# EAGLE schematic solar_backup_system (EAGLE 6.1)
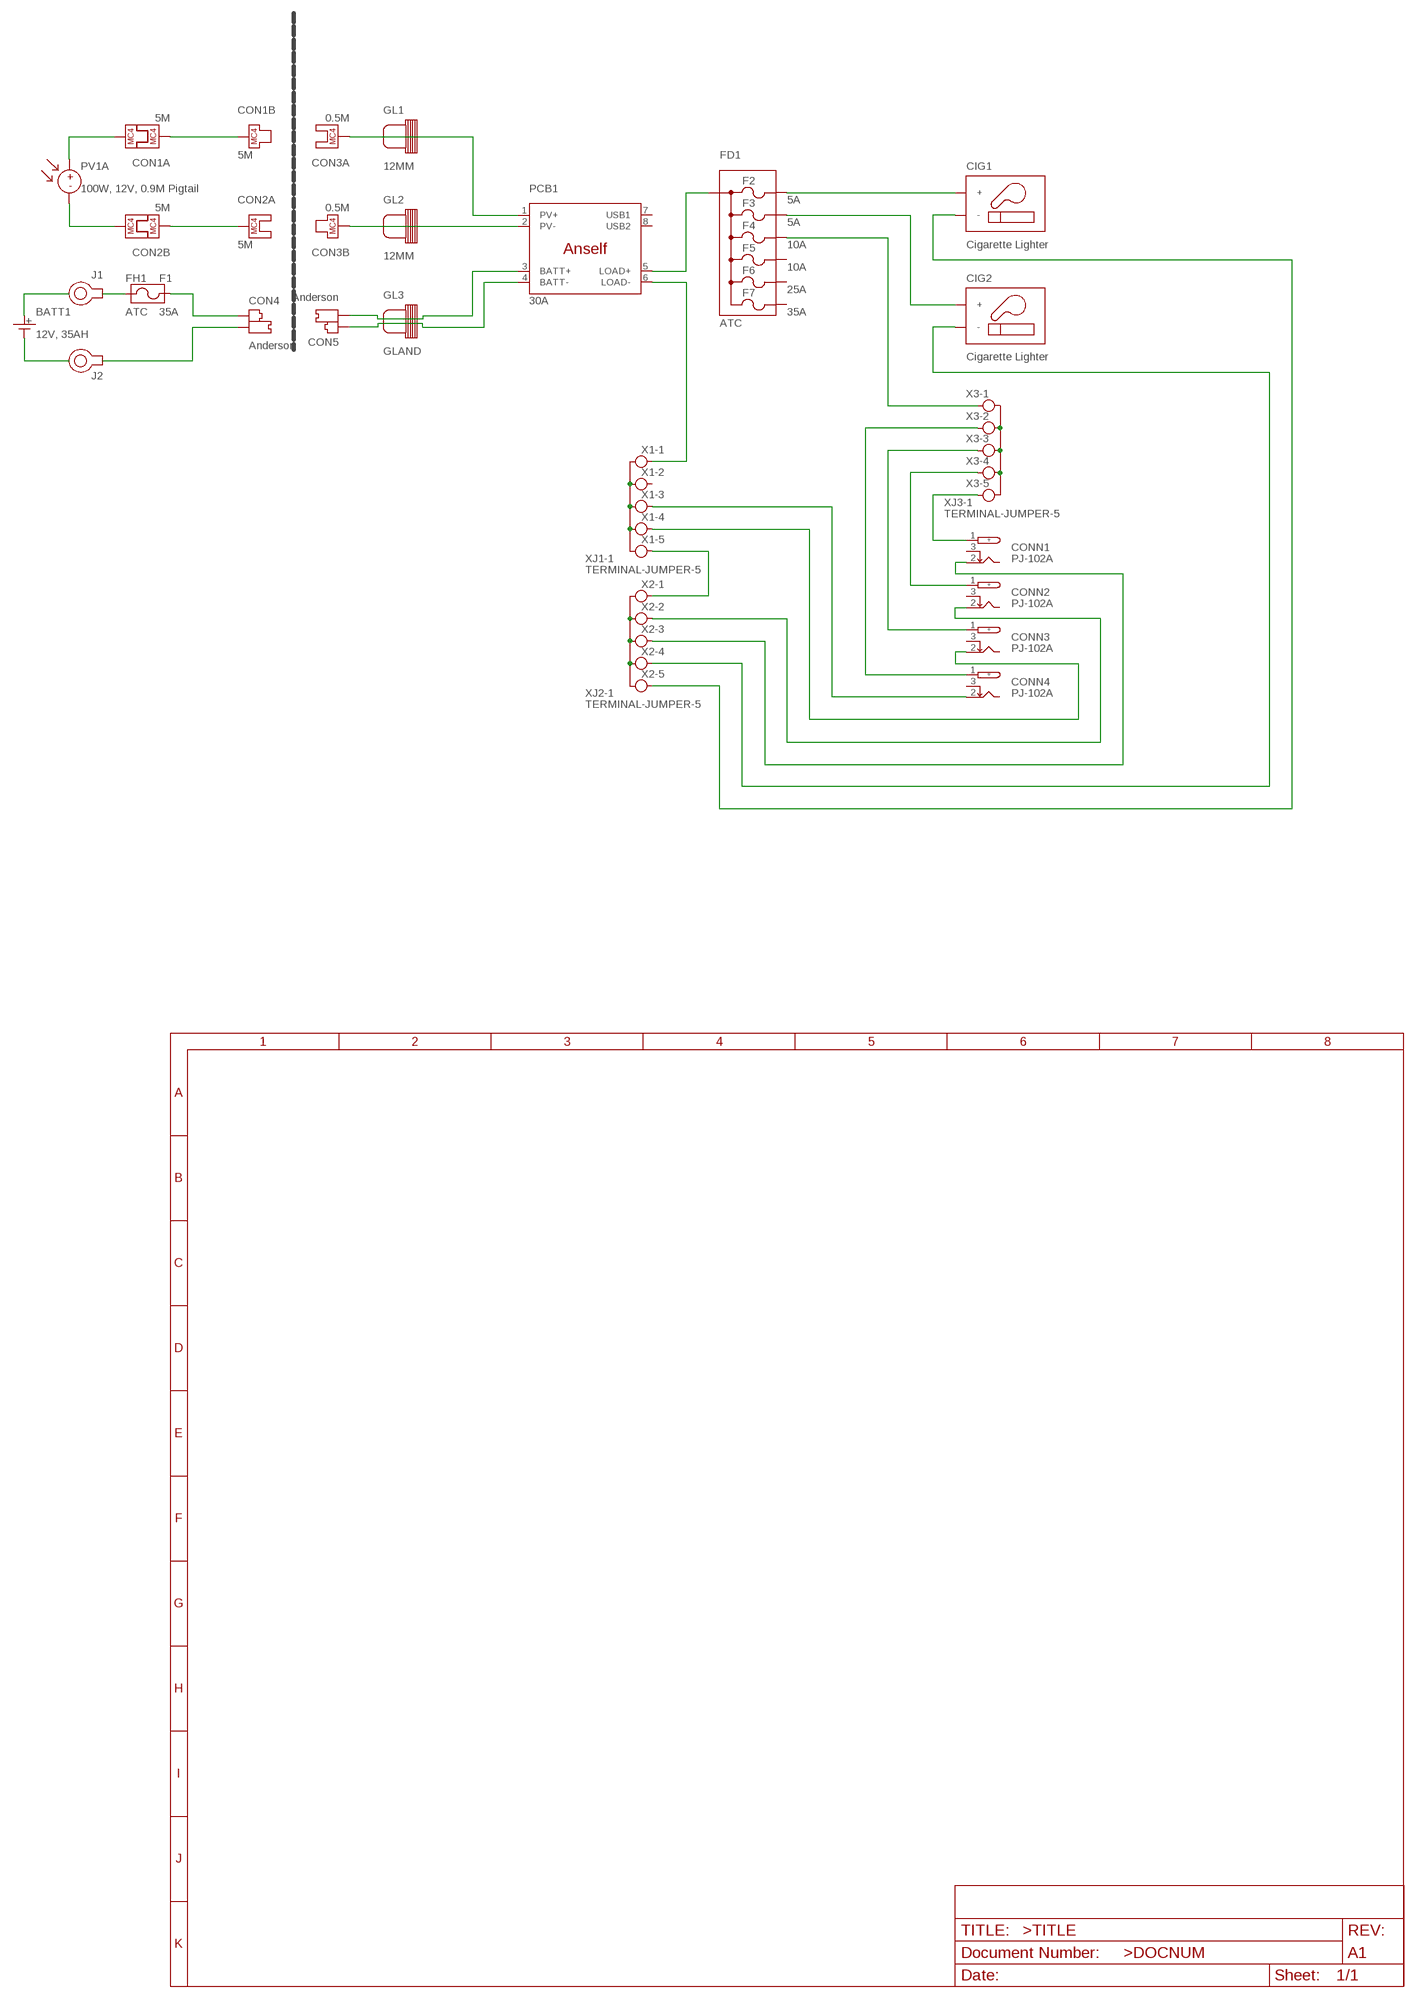
[diagram p0: schematic, sheet 1]

## Parts
BATT1  12V, 35AH  BATT-12V-35AH  [120]
CIG1  Cigarette Lighter  CIG-LIGHTER-SOCKET  [120]
CIG2  Cigarette Lighter  CIG-LIGHTER-SOCKET  [120]
CON1  5M  MC4-5M  [120]
CON2  5M  MC4-5M  [120]
CON3  0.5M  MC4-1M  [120]
CON4  Anderson  ANDERSON-POWERPOLE  [120]
CON5  Anderson  ANDERSON-POWERPOLE  [120]
CONN1  BARREL-JACK-2.1X5.5MM  [DC-BARREL-PJ-102A]
CONN2  BARREL-JACK-2.1X5.5MM  [DC-BARREL-PJ-102A]
CONN3  BARREL-JACK-2.1X5.5MM  [DC-BARREL-PJ-102A]
CONN4  BARREL-JACK-2.1X5.5MM  [DC-BARREL-PJ-102A]
F1  35A  FUSE-35A  [120]
F2  5A  FUSE-5A  [120]
F3  5A  FUSE-5A  [120]
F4  10A  FUSE-10A  [120]
F5  10A  FUSE-10A  [120]
F6  25A  FUSE-25A  [120]
F7  35A  FUSE-35A  [120]
FD1  ATC  FUSED-DISTRIBUTOR-6  [120]
FH1  ATC  FUSE-HOLDER-ATC  [120]
GL1  12MM  GLAND-12MM  [120]
GL2  12MM  GLAND-12MM  [120]
GL3  GLAND  [120]
J1  RING-TERMINAL  [120]
J2  RING-TERMINAL  [120]
PCB1  30A  ANSELF-PWM-SOLAR-CHARGE-CONTROLLER-30A  [120]
PV1  100W, 12V, 0.9M Pigtail  PV-PANEL-100W-12V  [120]
U$1  FRAME-8.5X11-LANDSCAPE-LET  [FRAME-11X17-LANDSCAPE]
X1  5POS  TERMINAL-STRIP-5-3.8MM  [120]
X2  5POS  TERMINAL-STRIP-5-3.8MM  [120]
X3  5POS  TERMINAL-STRIP-5-3.8MM  [120]
XJ1  TERMINAL-JUMPER-5  [120]
XJ2  TERMINAL-JUMPER-5  [120]
XJ3  TERMINAL-JUMPER-5  [120]

## Nets
N$1: PV1.1(A:+) PV1.3
N$2: PV1.2(A:-) PV1.5
N$3: CON1.2 PV1.4
N$4: CON2.4 PV1.6
N$5: CON1.1 CON1.3
N$6: CON2.1 CON2.3
N$7: BATT1.1(+) J1.2
N$8: BATT1.2(-) J2.2
N$9: CON3.1 PCB1.1(PV+)
N$10: CON3.3 PCB1.2(PV-)
N$11: CON4.2 J2.1
N$12: CON4.1 FH1.1
N$13: CON5.2 PCB1.3(BATT+)
N$14: CON5.1 PCB1.4(BATT-)
N$15: F1.2 FH1.3
N$16: F1.1 FH1.2
N$17: FH1.4 J1.1
N$18: X1.1 XJ1.1
N$19: X1.4 XJ1.2 XJ1.3
N$20: X1.7 XJ1.4 XJ1.5
N$21: X1.10 XJ1.6 XJ1.7
N$22: X1.13 XJ1.8
N$23: PCB1.6(LOAD-) X1.2
N$24: F2.2 FD1.9
N$25: F2.1 FD1.8
N$26: F3.2 FD1.11
N$27: F3.1 FD1.10
N$28: F4.2 FD1.13
N$29: F4.1 FD1.12
N$30: F5.2 FD1.15
N$31: F5.1 FD1.14
N$32: F6.2 FD1.17
N$33: F6.1 FD1.16
N$34: F7.2 FD1.19
N$35: F7.1 FD1.18
N$36: FD1.1 PCB1.5(LOAD+)
N$37: X2.1 XJ2.1
N$38: X2.4 XJ2.2 XJ2.3
N$39: X3.1 XJ3.1
N$40: X3.4 XJ3.2 XJ3.3
N$41: X3.7 XJ3.4 XJ3.5
N$42: X3.10 XJ3.6 XJ3.7
N$43: X2.7 XJ2.4 XJ2.5
N$44: X2.10 XJ2.6 XJ2.7
N$45: X2.13 XJ2.8
N$46: X1.14 X2.2
N$47: X3.13 XJ3.8
N$48: CIG1.1(+) FD1.2
N$49: CIG2.1(+) FD1.3
N$50: FD1.4 X3.2
N$51: CIG2.2(-) X2.11
N$52: CIG1.2(-) X2.14
N$53: CONN4.1(TIP) X3.5
N$54: CONN3.1(TIP) X3.8
N$55: CONN2.1(TIP) X3.11
N$56: CONN1.1(TIP) X3.14
N$57: CONN1.2(RING) X2.8
N$59: CONN2.2(RING) X2.5
N$60: CONN3.2(RING) X1.11
N$61: CONN4.2(RING) X1.8
Unconnected: CON1.4 CON2.2 CON3.2 CON3.4 CON4.3 CON5.3 CONN1.3(SWITCH) CONN2.3(SWITCH) CONN3.3(SWITCH) CONN4.3(SWITCH) FD1.5 FD1.6 FD1.7 PCB1.7(USB1) PCB1.8(USB2) X1.3 X1.5 X1.6 X1.9 X1.12 X1.15 X2.3 X2.6 X2.9 X2.12 X2.15 X3.3 X3.6 X3.9 X3.12 X3.15

## Library data of the parts
BATT1 = bbb:BATT; MFG: MightyMax; PN: ML35-12; VOLTAGE: 12VDC
CIG1 CIG2 = bbb:CIG-LIGHTER-SOCKET; VOLTAGE: 12VDC
CON1 CON2 = bbb:MC4
CON3 = bbb:MC4; VALUE: 1M
CON4 CON5 = bbb:ANDERSON-POWERPOLE
CONN1-CONN4 = aaa:BARREL-JACK: Barrel Jack; DIGIKEY: CP-102A-ND; MFG: CUI Inc; PN: PJ-102A
F1-F7 = bbb:FUSE; SIZE: ATC
FD1 = bbb:FUSED-DISTRIBUTOR-6; VOLTAGE: 12VDC
FH1 = bbb:FUSE-HOLDER
GL1-GL3 = bbb:GLAND
J1 J2 = bbb:RING-TERMINAL
PCB1 = bbb:ANSELF-PWM-SOLAR-CHARGE-CONTROLLER; MFG: Anself; PN: CMTD; POWER: 360/720W; VOLTAGE: 12/24VDC
PV1 = bbb:PV-PANEL; LINK: http://www.ebay.com/itm/NewPowa-100-Watt-100W-Watts-Solar-Panel-12V-Volt-Poly-Off-Grid-Battery-Charge-RV-/121349481312?epid=1861525737&hash=item1c40fe2360:g:6NcAAOSwRoxXnuLo; MFG: NewPowa; PN: NPA100-12; POWER: 100W; VOLTAGE: 12VDC
U$1 = aaa:FRAME-8.5X11-LANDSCAPE; DOCNUM: >DOCNUM; REV: A1; TITLE: >TITLE
X1-X3 = bbb:TERMINAL-STRIP-5; VOLTAGE: 600VDC
XJ1-XJ3 = bbb:TERMINAL-JUMPER-5